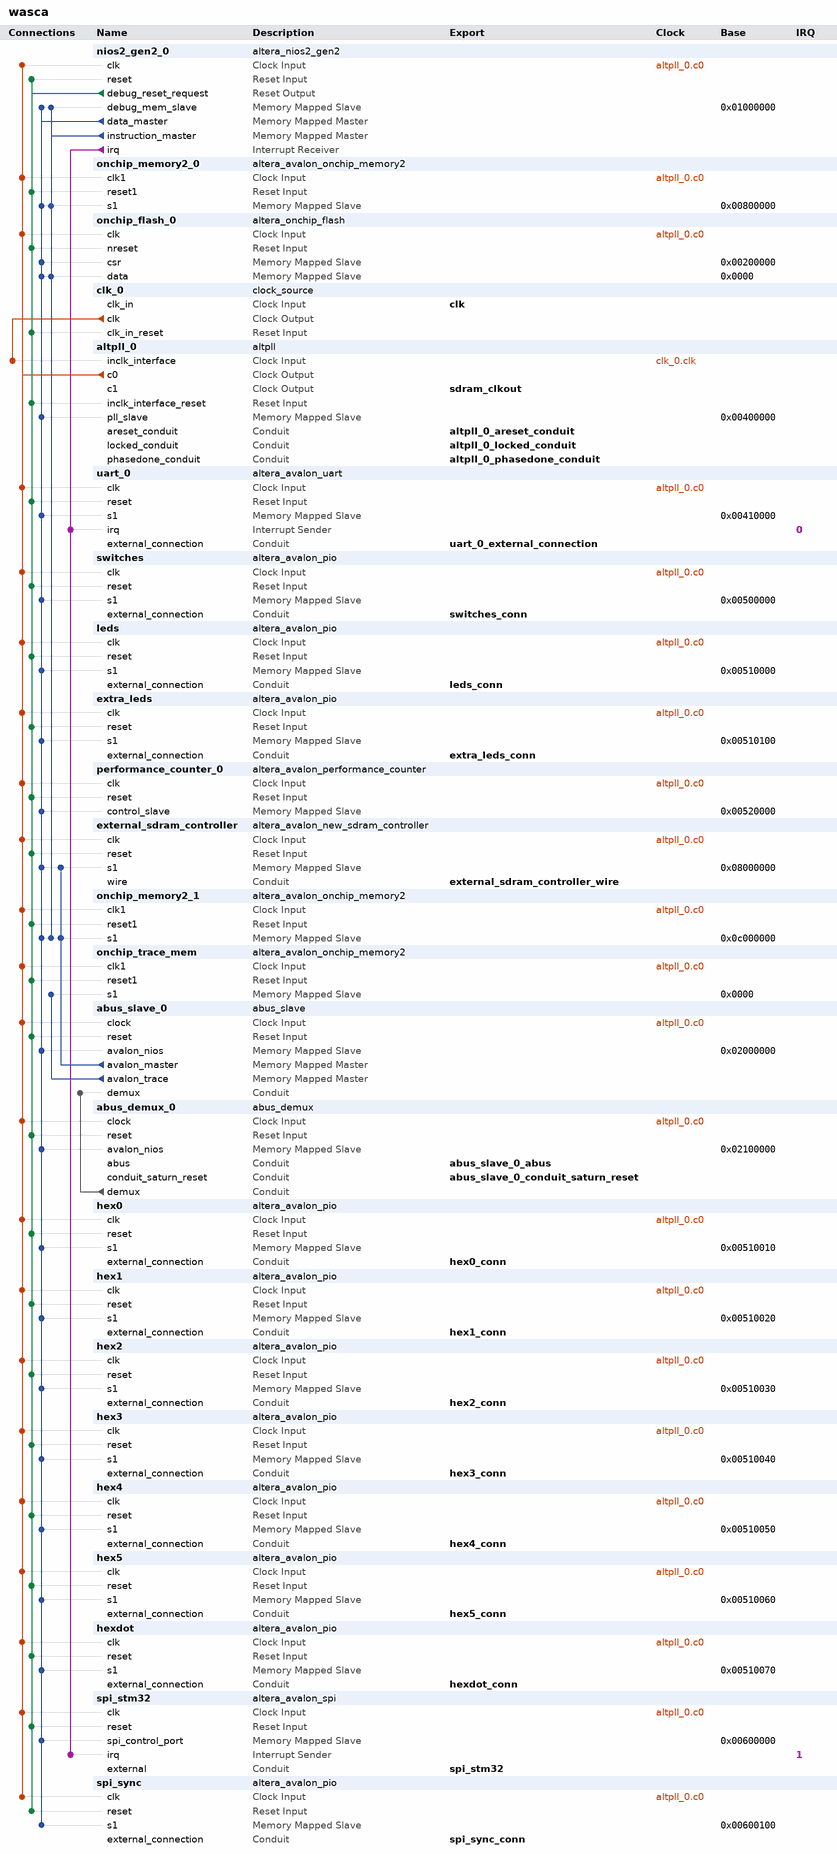
[diagram p0: system contents]
# Platform Designer (Qsys) system wasca, MAX 10 10M50DAF484C7G
# Parameters at their usual value, and those the tool derives, are not listed.
package require -exact qsys 15.1
create_system wasca
set_project_property DEVICE_FAMILY {MAX 10}
set_project_property DEVICE 10M50DAF484C7G

add_instance nios2_gen2_0 altera_nios2_gen2 15.1
set_instance_parameter_value nios2_gen2_0 dcache_size 0
set_instance_parameter_value nios2_gen2_0 debug_hwbreakpoint 4
set_instance_parameter_value nios2_gen2_0 exceptionSlave onchip_memory2_0.s1
set_instance_parameter_value nios2_gen2_0 icache_size 0
set_instance_parameter_value nios2_gen2_0 impl Tiny
set_instance_parameter_value nios2_gen2_0 resetSlave onchip_flash_0.data
set_instance_parameter_value nios2_gen2_0 resetrequest_enabled false

add_instance onchip_memory2_0 altera_avalon_onchip_memory2 15.1
set_instance_parameter_value onchip_memory2_0 dataWidth 32
set_instance_parameter_value onchip_memory2_0 dualPort false
set_instance_parameter_value onchip_memory2_0 initMemContent false
set_instance_parameter_value onchip_memory2_0 initializationFileName onchip_mem.hex
set_instance_parameter_value onchip_memory2_0 memorySize 32768

add_instance onchip_flash_0 altera_onchip_flash 15.1.1
set_instance_parameter_value onchip_flash_0 CONFIGURATION_MODE {Single Uncompressed Image}
set_instance_parameter_value onchip_flash_0 SECTOR_ACCESS_MODE {Read and write,Read and write,Read and write,Read and write,Read and write}
set_instance_parameter_value onchip_flash_0 initFlashContent false
set_instance_parameter_value onchip_flash_0 initializationFileName D:/github/wascafe/v12/firmware/hello/software/wasca_test9/mem_init/wasca_onchip_memory2_0.hex
set_instance_parameter_value onchip_flash_0 useNonDefaultInitFile true

add_instance clk_0 clock_source 15.1
set_instance_parameter_value clk_0 clockFrequency 50000000

add_instance altpll_0 altpll 15.1
set_instance_parameter_value altpll_0 CLK0_DIVIDE_BY 1
set_instance_parameter_value altpll_0 CLK0_MULTIPLY_BY 2
set_instance_parameter_value altpll_0 CLK1_DIVIDE_BY 1
set_instance_parameter_value altpll_0 CLK1_DUTY_CYCLE 50
set_instance_parameter_value altpll_0 CLK1_MULTIPLY_BY 2
set_instance_parameter_value altpll_0 CLK1_PHASE_SHIFT -3000
set_instance_parameter_value altpll_0 INCLK0_INPUT_FREQUENCY 20000
set_instance_parameter_value altpll_0 PORT_ARESET PORT_UNUSED
set_instance_parameter_value altpll_0 PORT_LOCKED PORT_USED
set_instance_parameter_value altpll_0 PORT_clk1 PORT_USED
set_instance_parameter_value altpll_0 PORT_clk2 PORT_UNUSED
set_instance_parameter_value altpll_0 PORT_clk3 PORT_UNUSED

add_instance uart_0 altera_avalon_uart 15.1
set_instance_parameter_value uart_0 baud 115200
set_instance_parameter_value uart_0 dataBits 8
set_instance_parameter_value uart_0 fixedBaud false
set_instance_parameter_value uart_0 parity ODD
set_instance_parameter_value uart_0 stopBits 1

add_instance switches altera_avalon_pio 15.1
set_instance_parameter_value switches direction Input
set_instance_parameter_value switches simDoTestBenchWiring true
set_instance_parameter_value switches width 8

add_instance leds altera_avalon_pio 15.1
set_instance_parameter_value leds direction Output
set_instance_parameter_value leds width 4

add_instance extra_leds altera_avalon_pio 15.1
set_instance_parameter_value extra_leds direction Output
set_instance_parameter_value extra_leds width 5

add_instance performance_counter_0 altera_avalon_performance_counter 15.1
set_instance_parameter_value performance_counter_0 numberOfSections 1

add_instance external_sdram_controller altera_avalon_new_sdram_controller 15.1
set_instance_parameter_value external_sdram_controller TAC 5.4
set_instance_parameter_value external_sdram_controller TRCD 15.0
set_instance_parameter_value external_sdram_controller TRP 15.0
set_instance_parameter_value external_sdram_controller casLatency 3
set_instance_parameter_value external_sdram_controller columnWidth 10
set_instance_parameter_value external_sdram_controller dataWidth 16
set_instance_parameter_value external_sdram_controller generateSimulationModel false
set_instance_parameter_value external_sdram_controller model single_Micron_MT48LC4M32B2_7_chip
set_instance_parameter_value external_sdram_controller numberOfBanks 4
set_instance_parameter_value external_sdram_controller numberOfChipSelects 1
set_instance_parameter_value external_sdram_controller powerUpDelay 100.0
set_instance_parameter_value external_sdram_controller refreshPeriod 7.8125
set_instance_parameter_value external_sdram_controller rowWidth 13

add_instance onchip_memory2_1 altera_avalon_onchip_memory2 15.1
set_instance_parameter_value onchip_memory2_1 dataWidth 32
set_instance_parameter_value onchip_memory2_1 dualPort false
set_instance_parameter_value onchip_memory2_1 initMemContent false
set_instance_parameter_value onchip_memory2_1 initializationFileName onchip_mem.hex
set_instance_parameter_value onchip_memory2_1 memorySize 4096

add_instance onchip_trace_mem altera_avalon_onchip_memory2 15.1
set_instance_parameter_value onchip_trace_mem dataWidth 64
set_instance_parameter_value onchip_trace_mem dualPort false
set_instance_parameter_value onchip_trace_mem initMemContent true
set_instance_parameter_value onchip_trace_mem initializationFileName onchip_mem.hex
set_instance_parameter_value onchip_trace_mem memorySize 4096

add_instance abus_slave_0 abus_slave 1.2

add_instance abus_demux_0 abus_demux 1.1

add_instance hex0 altera_avalon_pio 15.1
set_instance_parameter_value hex0 direction Output
set_instance_parameter_value hex0 resetValue 127
set_instance_parameter_value hex0 width 7

add_instance hex1 altera_avalon_pio 15.1
set_instance_parameter_value hex1 direction Output
set_instance_parameter_value hex1 resetValue 127
set_instance_parameter_value hex1 width 7

add_instance hex2 altera_avalon_pio 15.1
set_instance_parameter_value hex2 direction Output
set_instance_parameter_value hex2 resetValue 127
set_instance_parameter_value hex2 width 7

add_instance hex3 altera_avalon_pio 15.1
set_instance_parameter_value hex3 direction Output
set_instance_parameter_value hex3 resetValue 127
set_instance_parameter_value hex3 width 7

add_instance hex4 altera_avalon_pio 15.1
set_instance_parameter_value hex4 direction Output
set_instance_parameter_value hex4 resetValue 127
set_instance_parameter_value hex4 width 7

add_instance hex5 altera_avalon_pio 15.1
set_instance_parameter_value hex5 direction Output
set_instance_parameter_value hex5 resetValue 127
set_instance_parameter_value hex5 width 7

add_instance hexdot altera_avalon_pio 15.1
set_instance_parameter_value hexdot direction Output
set_instance_parameter_value hexdot width 6

add_instance spi_stm32 altera_avalon_spi 15.1
set_instance_parameter_value spi_stm32 clockPolarity 0
set_instance_parameter_value spi_stm32 dataWidth 16
set_instance_parameter_value spi_stm32 masterSPI true
set_instance_parameter_value spi_stm32 numberOfSlaves 1
set_instance_parameter_value spi_stm32 targetClockRate 7142858

add_instance spi_sync altera_avalon_pio 15.1
set_instance_parameter_value spi_sync direction Input
set_instance_parameter_value spi_sync simDoTestBenchWiring true
set_instance_parameter_value spi_sync width 1

# connections
add_connection altpll_0.c0 abus_demux_0.clock clock
add_connection altpll_0.c0 abus_slave_0.clock clock
add_connection altpll_0.c0 external_sdram_controller.clk clock
add_connection altpll_0.c0 extra_leds.clk clock
add_connection altpll_0.c0 hex0.clk clock
add_connection altpll_0.c0 hex1.clk clock
add_connection altpll_0.c0 hex2.clk clock
add_connection altpll_0.c0 hex3.clk clock
add_connection altpll_0.c0 hex4.clk clock
add_connection altpll_0.c0 hex5.clk clock
add_connection altpll_0.c0 hexdot.clk clock
add_connection altpll_0.c0 leds.clk clock
add_connection altpll_0.c0 nios2_gen2_0.clk clock
add_connection altpll_0.c0 onchip_flash_0.clk clock
add_connection altpll_0.c0 onchip_memory2_0.clk1 clock
add_connection altpll_0.c0 onchip_memory2_1.clk1 clock
add_connection altpll_0.c0 onchip_trace_mem.clk1 clock
add_connection altpll_0.c0 performance_counter_0.clk clock
add_connection altpll_0.c0 spi_stm32.clk clock
add_connection altpll_0.c0 spi_sync.clk clock
add_connection altpll_0.c0 switches.clk clock
add_connection altpll_0.c0 uart_0.clk clock
add_connection clk_0.clk altpll_0.inclk_interface clock
add_connection nios2_gen2_0.debug_reset_request abus_demux_0.reset reset
add_connection nios2_gen2_0.debug_reset_request abus_slave_0.reset reset
add_connection nios2_gen2_0.debug_reset_request altpll_0.inclk_interface_reset reset
add_connection nios2_gen2_0.debug_reset_request clk_0.clk_in_reset reset
add_connection nios2_gen2_0.debug_reset_request external_sdram_controller.reset reset
add_connection nios2_gen2_0.debug_reset_request extra_leds.reset reset
add_connection nios2_gen2_0.debug_reset_request hex0.reset reset
add_connection nios2_gen2_0.debug_reset_request hex1.reset reset
add_connection nios2_gen2_0.debug_reset_request hex2.reset reset
add_connection nios2_gen2_0.debug_reset_request hex3.reset reset
add_connection nios2_gen2_0.debug_reset_request hex4.reset reset
add_connection nios2_gen2_0.debug_reset_request hex5.reset reset
add_connection nios2_gen2_0.debug_reset_request hexdot.reset reset
add_connection nios2_gen2_0.debug_reset_request leds.reset reset
add_connection nios2_gen2_0.debug_reset_request nios2_gen2_0.reset reset
add_connection nios2_gen2_0.debug_reset_request onchip_flash_0.nreset reset
add_connection nios2_gen2_0.debug_reset_request onchip_memory2_0.reset1 reset
add_connection nios2_gen2_0.debug_reset_request onchip_memory2_1.reset1 reset
add_connection nios2_gen2_0.debug_reset_request onchip_trace_mem.reset1 reset
add_connection nios2_gen2_0.debug_reset_request performance_counter_0.reset reset
add_connection nios2_gen2_0.debug_reset_request spi_stm32.reset reset
add_connection nios2_gen2_0.debug_reset_request spi_sync.reset reset
add_connection nios2_gen2_0.debug_reset_request switches.reset reset
add_connection nios2_gen2_0.debug_reset_request uart_0.reset reset
add_connection abus_slave_0.avalon_master external_sdram_controller.s1 avalon
set_connection_parameter_value abus_slave_0.avalon_master/external_sdram_controller.s1 baseAddress 0x08000000
add_connection abus_slave_0.avalon_master onchip_memory2_1.s1 avalon
set_connection_parameter_value abus_slave_0.avalon_master/onchip_memory2_1.s1 baseAddress 0x0c000000
add_connection abus_slave_0.avalon_trace onchip_trace_mem.s1 avalon
set_connection_parameter_value abus_slave_0.avalon_trace/onchip_trace_mem.s1 baseAddress 0x0000
add_connection nios2_gen2_0.data_master abus_demux_0.avalon_nios avalon
set_connection_parameter_value nios2_gen2_0.data_master/abus_demux_0.avalon_nios baseAddress 0x02100000
add_connection nios2_gen2_0.data_master abus_slave_0.avalon_nios avalon
set_connection_parameter_value nios2_gen2_0.data_master/abus_slave_0.avalon_nios baseAddress 0x02000000
add_connection nios2_gen2_0.data_master altpll_0.pll_slave avalon
set_connection_parameter_value nios2_gen2_0.data_master/altpll_0.pll_slave baseAddress 0x00400000
add_connection nios2_gen2_0.data_master external_sdram_controller.s1 avalon
set_connection_parameter_value nios2_gen2_0.data_master/external_sdram_controller.s1 baseAddress 0x08000000
add_connection nios2_gen2_0.data_master extra_leds.s1 avalon
set_connection_parameter_value nios2_gen2_0.data_master/extra_leds.s1 baseAddress 0x00510100
add_connection nios2_gen2_0.data_master hex0.s1 avalon
set_connection_parameter_value nios2_gen2_0.data_master/hex0.s1 baseAddress 0x00510010
add_connection nios2_gen2_0.data_master hex1.s1 avalon
set_connection_parameter_value nios2_gen2_0.data_master/hex1.s1 baseAddress 0x00510020
add_connection nios2_gen2_0.data_master hex2.s1 avalon
set_connection_parameter_value nios2_gen2_0.data_master/hex2.s1 baseAddress 0x00510030
add_connection nios2_gen2_0.data_master hex3.s1 avalon
set_connection_parameter_value nios2_gen2_0.data_master/hex3.s1 baseAddress 0x00510040
add_connection nios2_gen2_0.data_master hex4.s1 avalon
set_connection_parameter_value nios2_gen2_0.data_master/hex4.s1 baseAddress 0x00510050
add_connection nios2_gen2_0.data_master hex5.s1 avalon
set_connection_parameter_value nios2_gen2_0.data_master/hex5.s1 baseAddress 0x00510060
add_connection nios2_gen2_0.data_master hexdot.s1 avalon
set_connection_parameter_value nios2_gen2_0.data_master/hexdot.s1 baseAddress 0x00510070
add_connection nios2_gen2_0.data_master leds.s1 avalon
set_connection_parameter_value nios2_gen2_0.data_master/leds.s1 baseAddress 0x00510000
add_connection nios2_gen2_0.data_master nios2_gen2_0.debug_mem_slave avalon
set_connection_parameter_value nios2_gen2_0.data_master/nios2_gen2_0.debug_mem_slave baseAddress 0x01000000
add_connection nios2_gen2_0.data_master onchip_flash_0.csr avalon
set_connection_parameter_value nios2_gen2_0.data_master/onchip_flash_0.csr baseAddress 0x00200000
add_connection nios2_gen2_0.data_master onchip_flash_0.data avalon
set_connection_parameter_value nios2_gen2_0.data_master/onchip_flash_0.data baseAddress 0x0000
add_connection nios2_gen2_0.data_master onchip_memory2_0.s1 avalon
set_connection_parameter_value nios2_gen2_0.data_master/onchip_memory2_0.s1 baseAddress 0x00800000
add_connection nios2_gen2_0.data_master onchip_memory2_1.s1 avalon
set_connection_parameter_value nios2_gen2_0.data_master/onchip_memory2_1.s1 baseAddress 0x0c000000
add_connection nios2_gen2_0.data_master performance_counter_0.control_slave avalon
set_connection_parameter_value nios2_gen2_0.data_master/performance_counter_0.control_slave baseAddress 0x00520000
add_connection nios2_gen2_0.data_master spi_stm32.spi_control_port avalon
set_connection_parameter_value nios2_gen2_0.data_master/spi_stm32.spi_control_port baseAddress 0x00600000
add_connection nios2_gen2_0.data_master spi_sync.s1 avalon
set_connection_parameter_value nios2_gen2_0.data_master/spi_sync.s1 baseAddress 0x00600100
add_connection nios2_gen2_0.data_master switches.s1 avalon
set_connection_parameter_value nios2_gen2_0.data_master/switches.s1 baseAddress 0x00500000
add_connection nios2_gen2_0.data_master uart_0.s1 avalon
set_connection_parameter_value nios2_gen2_0.data_master/uart_0.s1 baseAddress 0x00410000
add_connection nios2_gen2_0.instruction_master nios2_gen2_0.debug_mem_slave avalon
set_connection_parameter_value nios2_gen2_0.instruction_master/nios2_gen2_0.debug_mem_slave baseAddress 0x01000000
add_connection nios2_gen2_0.instruction_master onchip_flash_0.data avalon
set_connection_parameter_value nios2_gen2_0.instruction_master/onchip_flash_0.data baseAddress 0x0000
add_connection nios2_gen2_0.instruction_master onchip_memory2_0.s1 avalon
set_connection_parameter_value nios2_gen2_0.instruction_master/onchip_memory2_0.s1 baseAddress 0x00800000
add_connection nios2_gen2_0.instruction_master onchip_memory2_1.s1 avalon
set_connection_parameter_value nios2_gen2_0.instruction_master/onchip_memory2_1.s1 baseAddress 0x0c000000
add_connection abus_demux_0.demux abus_slave_0.demux conduit
add_connection nios2_gen2_0.irq spi_stm32.irq interrupt
set_connection_parameter_value nios2_gen2_0.irq/spi_stm32.irq irqNumber 1
add_connection nios2_gen2_0.irq uart_0.irq interrupt
set_connection_parameter_value nios2_gen2_0.irq/uart_0.irq irqNumber 0

# exported interfaces
add_interface abus_slave_0_abus conduit end
set_interface_property abus_slave_0_abus EXPORT_OF abus_demux_0.abus
add_interface abus_slave_0_conduit_saturn_reset conduit end
set_interface_property abus_slave_0_conduit_saturn_reset EXPORT_OF abus_demux_0.conduit_saturn_reset
add_interface altpll_0_areset_conduit conduit end
set_interface_property altpll_0_areset_conduit EXPORT_OF altpll_0.areset_conduit
add_interface altpll_0_locked_conduit conduit end
set_interface_property altpll_0_locked_conduit EXPORT_OF altpll_0.locked_conduit
add_interface altpll_0_phasedone_conduit conduit end
set_interface_property altpll_0_phasedone_conduit EXPORT_OF altpll_0.phasedone_conduit
add_interface clk clock sink
set_interface_property clk EXPORT_OF clk_0.clk_in
add_interface external_sdram_controller_wire conduit end
set_interface_property external_sdram_controller_wire EXPORT_OF external_sdram_controller.wire
add_interface extra_leds_conn conduit end
set_interface_property extra_leds_conn EXPORT_OF extra_leds.external_connection
add_interface hex0_conn conduit end
set_interface_property hex0_conn EXPORT_OF hex0.external_connection
add_interface hex1_conn conduit end
set_interface_property hex1_conn EXPORT_OF hex1.external_connection
add_interface hex2_conn conduit end
set_interface_property hex2_conn EXPORT_OF hex2.external_connection
add_interface hex3_conn conduit end
set_interface_property hex3_conn EXPORT_OF hex3.external_connection
add_interface hex4_conn conduit end
set_interface_property hex4_conn EXPORT_OF hex4.external_connection
add_interface hex5_conn conduit end
set_interface_property hex5_conn EXPORT_OF hex5.external_connection
add_interface hexdot_conn conduit end
set_interface_property hexdot_conn EXPORT_OF hexdot.external_connection
add_interface leds_conn conduit end
set_interface_property leds_conn EXPORT_OF leds.external_connection
add_interface sdram_clkout clock source
set_interface_property sdram_clkout EXPORT_OF altpll_0.c1
add_interface spi_stm32 conduit end
set_interface_property spi_stm32 EXPORT_OF spi_stm32.external
add_interface spi_sync_conn conduit end
set_interface_property spi_sync_conn EXPORT_OF spi_sync.external_connection
add_interface switches_conn conduit end
set_interface_property switches_conn EXPORT_OF switches.external_connection
add_interface uart_0_external_connection conduit end
set_interface_property uart_0_external_connection EXPORT_OF uart_0.external_connection

set_interconnect_requirement {$system} qsys_mm.clockCrossingAdapter HANDSHAKE
set_interconnect_requirement {$system} qsys_mm.insertDefaultSlave FALSE
set_interconnect_requirement {$system} qsys_mm.maxAdditionalLatency 1

save_system wasca.qsys
